# EAGLE schematic ws2821b-block (EAGLE 8.3.2)
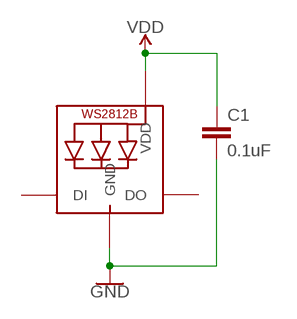
[diagram p0: schematic, sheet 1]

## Parts
C1  0.1uF  0.1UF-0603-25V-(+80/-20%)  [0603]
LED1  WS2812B5050  [WS2812B]

## Nets
GND: C1.2 LED1.3-GND(GND)
VDD: C1.1 LED1.1-VDD(VDD)
Unconnected: LED1.2-DOUT(DO) LED1.4-DIN(DI)

## Library data of the parts
C1 = SparkFun-Capacitors:0.1UF: 0.1µF ceramic capacitors A capacitor is a passive two-terminal electrical component used to store electrical energy temporarily in an electric field.; PROD_ID: CAP-00810
LED1 = adafruit:WS2812B